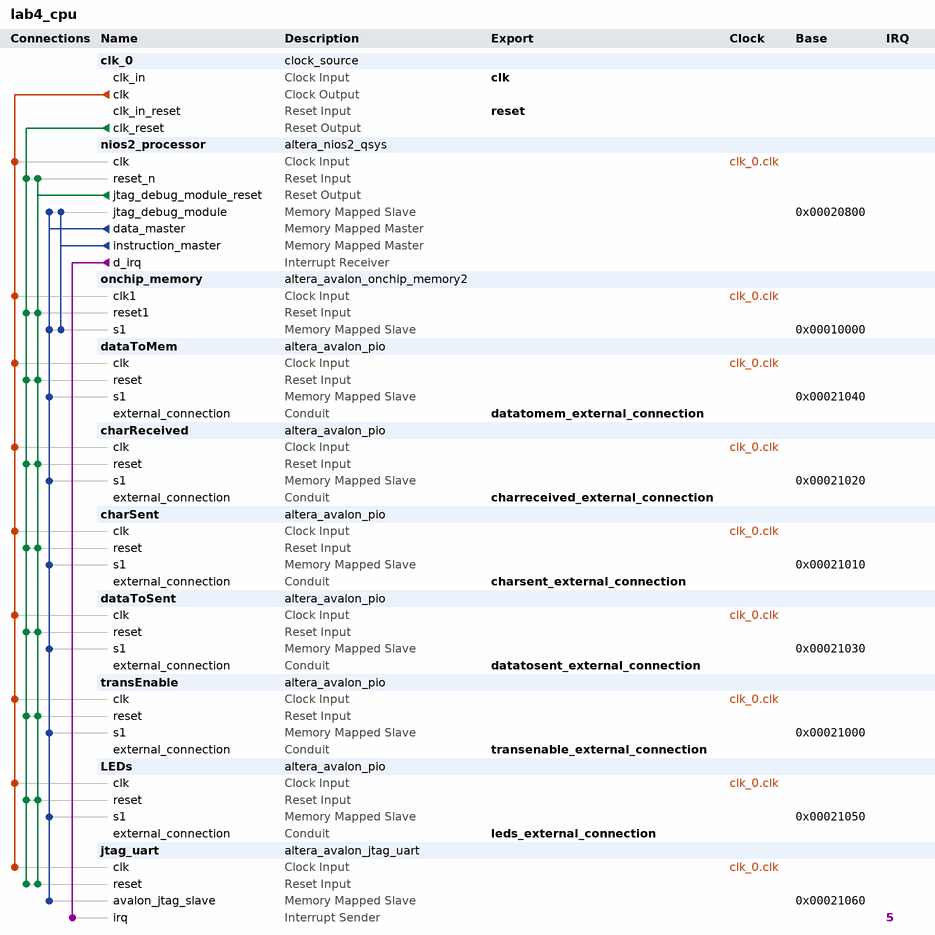
[diagram p0: system contents]
# Platform Designer (Qsys) system lab4_cpu, Cyclone V 5CSEMA5F31C6
# Parameters at their usual value, and those the tool derives, are not listed.
package require -exact qsys 14.0
create_system lab4_cpu
set_project_property DEVICE_FAMILY {Cyclone V}
set_project_property DEVICE 5CSEMA5F31C6

add_instance clk_0 clock_source 14.0
set_instance_parameter_value clk_0 clockFrequency 50000000

add_instance nios2_processor altera_nios2_qsys 14.0
set_instance_parameter_value nios2_processor resetrequest_enabled true
set_instance_parameter_value nios2_processor resetSlave onchip_memory.s1
set_instance_parameter_value nios2_processor mmu_TLBMissExcSlave None
set_instance_parameter_value nios2_processor exceptionSlave onchip_memory.s1
set_instance_parameter_value nios2_processor breakSlave nios2_processor.jtag_debug_module
set_instance_parameter_value nios2_processor muldiv_multiplierType NoneSmall
set_instance_parameter_value nios2_processor impl Tiny
set_instance_parameter_value nios2_processor icache_size 2048

add_instance onchip_memory altera_avalon_onchip_memory2 14.0
set_instance_parameter_value onchip_memory dataWidth 32
set_instance_parameter_value onchip_memory dualPort false
set_instance_parameter_value onchip_memory initMemContent true
set_instance_parameter_value onchip_memory initializationFileName onchip_mem.hex
set_instance_parameter_value onchip_memory memorySize 40960

add_instance dataToMem altera_avalon_pio 14.0
set_instance_parameter_value dataToMem direction Input
set_instance_parameter_value dataToMem width 8

add_instance charReceived altera_avalon_pio 14.0
set_instance_parameter_value charReceived direction Input
set_instance_parameter_value charReceived width 1

add_instance charSent altera_avalon_pio 14.0
set_instance_parameter_value charSent direction Input
set_instance_parameter_value charSent width 1

add_instance dataToSent altera_avalon_pio 14.0
set_instance_parameter_value dataToSent direction Output
set_instance_parameter_value dataToSent width 8

add_instance transEnable altera_avalon_pio 14.0
set_instance_parameter_value transEnable direction Output
set_instance_parameter_value transEnable width 1

add_instance LEDs altera_avalon_pio 14.0
set_instance_parameter_value LEDs direction Output
set_instance_parameter_value LEDs width 8

add_instance jtag_uart altera_avalon_jtag_uart 14.0
set_instance_parameter_value jtag_uart simInteractiveOptions NO_INTERACTIVE_WINDOWS

# connections
add_connection clk_0.clk charReceived.clk clock
add_connection clk_0.clk charSent.clk clock
add_connection clk_0.clk dataToMem.clk clock
add_connection clk_0.clk dataToSent.clk clock
add_connection clk_0.clk jtag_uart.clk clock
add_connection clk_0.clk LEDs.clk clock
add_connection clk_0.clk nios2_processor.clk clock
add_connection clk_0.clk onchip_memory.clk1 clock
add_connection clk_0.clk transEnable.clk clock
add_connection clk_0.clk_reset charReceived.reset reset
add_connection clk_0.clk_reset charSent.reset reset
add_connection clk_0.clk_reset dataToMem.reset reset
add_connection clk_0.clk_reset dataToSent.reset reset
add_connection clk_0.clk_reset jtag_uart.reset reset
add_connection clk_0.clk_reset LEDs.reset reset
add_connection clk_0.clk_reset nios2_processor.reset_n reset
add_connection clk_0.clk_reset onchip_memory.reset1 reset
add_connection clk_0.clk_reset transEnable.reset reset
add_connection nios2_processor.jtag_debug_module_reset charReceived.reset reset
add_connection nios2_processor.jtag_debug_module_reset charSent.reset reset
add_connection nios2_processor.jtag_debug_module_reset dataToMem.reset reset
add_connection nios2_processor.jtag_debug_module_reset dataToSent.reset reset
add_connection nios2_processor.jtag_debug_module_reset jtag_uart.reset reset
add_connection nios2_processor.jtag_debug_module_reset LEDs.reset reset
add_connection nios2_processor.jtag_debug_module_reset nios2_processor.reset_n reset
add_connection nios2_processor.jtag_debug_module_reset onchip_memory.reset1 reset
add_connection nios2_processor.jtag_debug_module_reset transEnable.reset reset
add_connection nios2_processor.data_master charReceived.s1 avalon
set_connection_parameter_value nios2_processor.data_master/charReceived.s1 baseAddress 0x00021020
add_connection nios2_processor.data_master charSent.s1 avalon
set_connection_parameter_value nios2_processor.data_master/charSent.s1 baseAddress 0x00021010
add_connection nios2_processor.data_master dataToMem.s1 avalon
set_connection_parameter_value nios2_processor.data_master/dataToMem.s1 baseAddress 0x00021040
add_connection nios2_processor.data_master dataToSent.s1 avalon
set_connection_parameter_value nios2_processor.data_master/dataToSent.s1 baseAddress 0x00021030
add_connection nios2_processor.data_master jtag_uart.avalon_jtag_slave avalon
set_connection_parameter_value nios2_processor.data_master/jtag_uart.avalon_jtag_slave baseAddress 0x00021060
add_connection nios2_processor.data_master LEDs.s1 avalon
set_connection_parameter_value nios2_processor.data_master/LEDs.s1 baseAddress 0x00021050
add_connection nios2_processor.data_master nios2_processor.jtag_debug_module avalon
set_connection_parameter_value nios2_processor.data_master/nios2_processor.jtag_debug_module baseAddress 0x00020800
add_connection nios2_processor.data_master onchip_memory.s1 avalon
set_connection_parameter_value nios2_processor.data_master/onchip_memory.s1 baseAddress 0x00010000
add_connection nios2_processor.data_master transEnable.s1 avalon
set_connection_parameter_value nios2_processor.data_master/transEnable.s1 baseAddress 0x00021000
add_connection nios2_processor.instruction_master nios2_processor.jtag_debug_module avalon
set_connection_parameter_value nios2_processor.instruction_master/nios2_processor.jtag_debug_module baseAddress 0x00020800
add_connection nios2_processor.instruction_master onchip_memory.s1 avalon
set_connection_parameter_value nios2_processor.instruction_master/onchip_memory.s1 baseAddress 0x00010000
add_connection nios2_processor.d_irq jtag_uart.irq interrupt
set_connection_parameter_value nios2_processor.d_irq/jtag_uart.irq irqNumber 5

# exported interfaces
add_interface clk clock sink
set_interface_property clk EXPORT_OF clk_0.clk_in
add_interface reset reset sink
set_interface_property reset EXPORT_OF clk_0.clk_in_reset
add_interface leds_external_connection conduit end
set_interface_property leds_external_connection EXPORT_OF LEDs.external_connection
add_interface datatomem_external_connection conduit end
set_interface_property datatomem_external_connection EXPORT_OF dataToMem.external_connection
add_interface datatosent_external_connection conduit end
set_interface_property datatosent_external_connection EXPORT_OF dataToSent.external_connection
add_interface charsent_external_connection conduit end
set_interface_property charsent_external_connection EXPORT_OF charSent.external_connection
add_interface charreceived_external_connection conduit end
set_interface_property charreceived_external_connection EXPORT_OF charReceived.external_connection
add_interface transenable_external_connection conduit end
set_interface_property transenable_external_connection EXPORT_OF transEnable.external_connection

set_interconnect_requirement {$system} qsys_mm.clockCrossingAdapter HANDSHAKE
set_interconnect_requirement {$system} qsys_mm.maxAdditionalLatency 1
set_interconnect_requirement {$system} qsys_mm.insertDefaultSlave FALSE

save_system lab4_cpu.qsys
